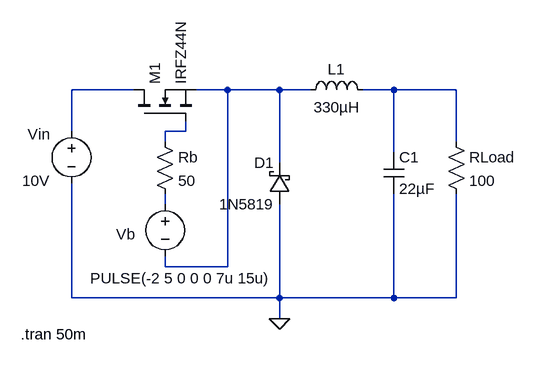
[diagram p0: schematic BuckMOSFET1.asc]
BuckMOSFET1.asc, the LTspice schematic file:
Version 4
SHEET 1 880 680
WIRE 128 96 32 96
WIRE 272 96 224 96
WIRE 352 96 272 96
WIRE 400 96 352 96
WIRE 528 96 480 96
WIRE 624 96 528 96
WIRE 32 160 32 96
WIRE 208 160 208 144
WIRE 208 160 176 160
WIRE 176 176 176 160
WIRE 624 176 624 96
WIRE 528 192 528 96
WIRE 352 208 352 96
WIRE 176 272 176 256
WIRE 176 368 176 352
WIRE 272 368 272 96
WIRE 272 368 176 368
WIRE 32 416 32 240
WIRE 352 416 352 272
WIRE 352 416 32 416
WIRE 528 416 528 256
WIRE 528 416 352 416
WIRE 624 416 624 256
WIRE 624 416 528 416
WIRE 352 448 352 416
FLAG 352 448 0
SYMBOL voltage 32 144 R0
WINDOW 0 -67 20 Left 2
WINDOW 3 -76 92 Left 2
WINDOW 123 0 0 Left 0
WINDOW 39 0 0 Left 0
SYMATTR InstName Vin
SYMATTR Value 10V
SYMBOL res 160 160 R0
SYMATTR InstName Rb
SYMATTR Value 50
SYMBOL ind 384 112 R270
WINDOW 0 32 56 VTop 2
WINDOW 3 5 56 VBottom 2
SYMATTR InstName L1
SYMATTR Value 330µH
SYMBOL cap 512 192 R0
SYMATTR InstName C1
SYMATTR Value 22µF
SYMBOL schottky 368 272 R180
WINDOW 0 24 64 Left 2
WINDOW 3 24 0 Left 2
SYMATTR InstName D1
SYMATTR Value 1N5819
SYMATTR Description Diode
SYMATTR Type diode
SYMBOL res 608 160 R0
SYMATTR InstName RLoad
SYMATTR Value 100
SYMBOL voltage 176 256 R0
WINDOW 0 -75 62 Left 2
WINDOW 3 -115 130 Left 2
WINDOW 123 0 0 Left 0
WINDOW 39 0 0 Left 0
SYMATTR InstName Vb
SYMATTR Value PULSE(-2 5 0 0 0 7u 15u)
SYMBOL nmos 128 144 R270
SYMATTR InstName M1
SYMATTR Value IRFZ44N
TEXT -46 472 Left 2 !.tran 50m

The netlist it stands for:
* BuckMOSFET1.asc
Vin N001 0 10V
Rb N004 N005 50
L1 N002 N003 330µH
C1 N003 0 22µF
D1 0 N002 1N5819
RLoad N003 0 100
Vb N005 N002 PULSE(-2 5 0 0 0 7u 15u)
M1 N001 N004 N002 N002 IRFZ44N
.model D D
.lib standard.dio
.model NMOS NMOS
.model PMOS PMOS
.lib standard.mos
.tran 50m
.backanno
.end